# Altium schematic sheet main.SchDoc
size A4
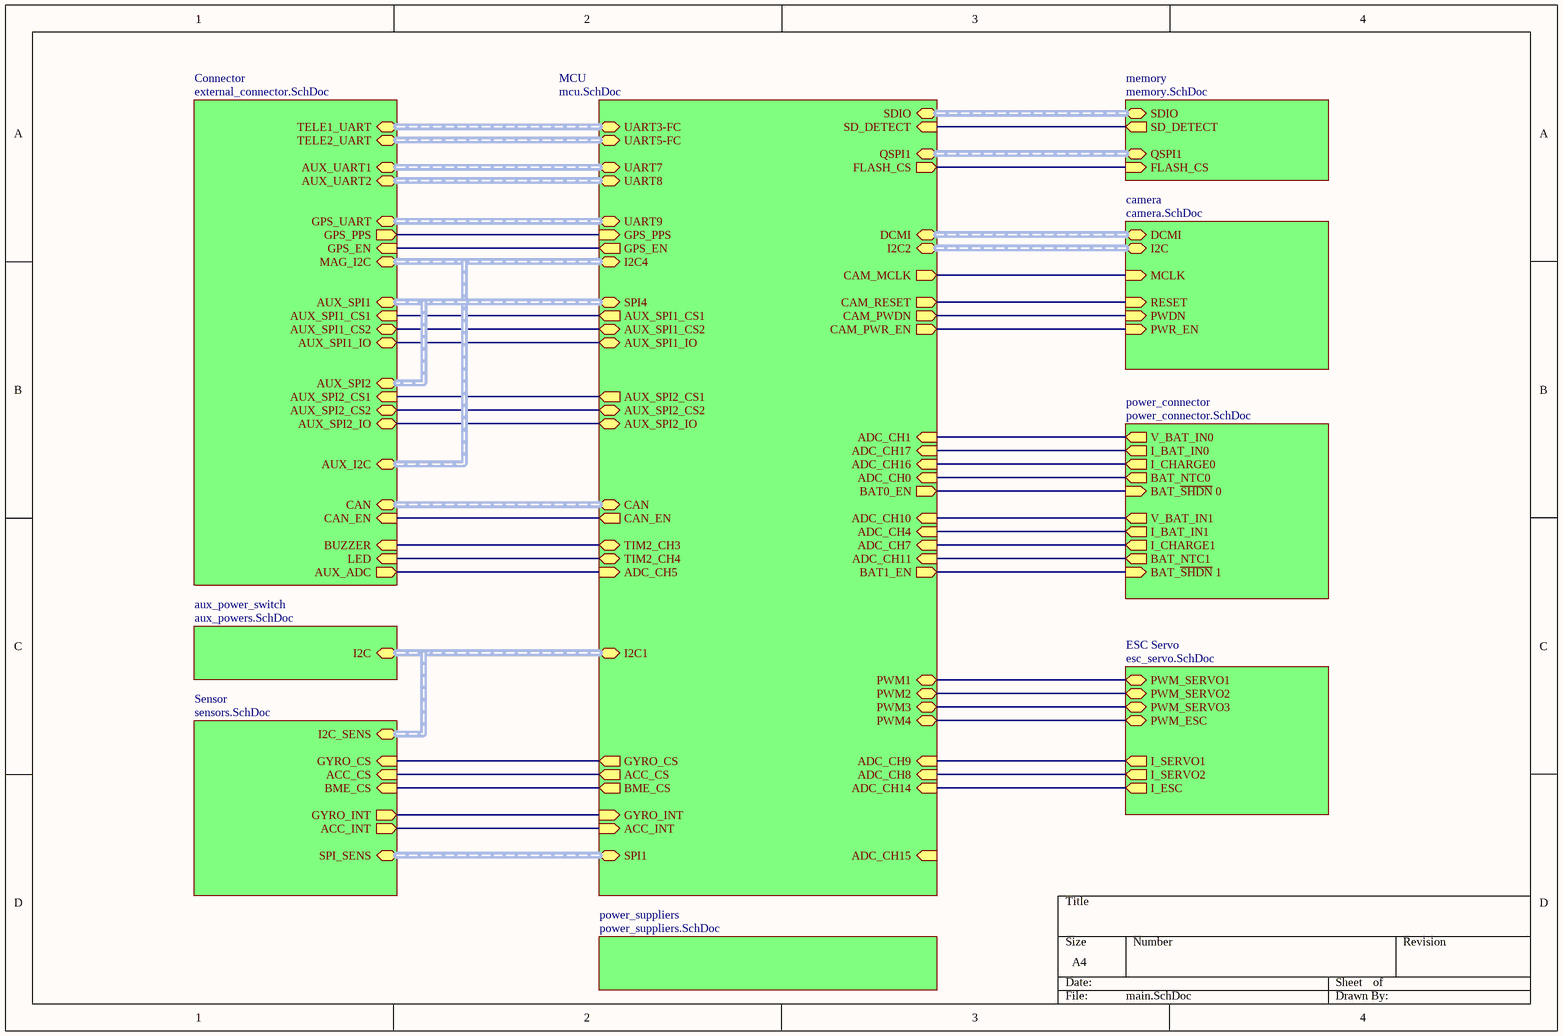
[diagram p0: main.SchDoc]

## Sub-sheets
aux_power_switch = aux_powers.SchDoc: I2C (harness I2C)
camera = camera.SchDoc: DCMI (harness DCMI), RESET (in), PWDN (in), I2C (harness I2C), MCLK (in), PWR_EN (in)
Connector = external_connector.SchDoc: TELE2_UART (harness UART-FC), CAN_EN (in), AUX_UART1 (harness UART), TELE1_UART (harness UART-FC), BUZZER (in), GPS_PPS (out), MAG_I2C (harness I2C), AUX_UART2 (harness UART), AUX_I2C (harness I2C), AUX_SPI2_IO (bidir), AUX_SPI2 (harness SPI), AUX_SPI1_IO (bidir), GPS_UART (harness UART), CAN (harness CAN), AUX_SPI1 (harness SPI), GPS_EN (in), LED (in), AUX_ADC (out), AUX_SPI2_CS2 (bidir), AUX_SPI2_CS1 (in), AUX_SPI1_CS1 (in), AUX_SPI1_CS2 (bidir)
ESC Servo = esc_servo.SchDoc: I_SERVO1 (out), PWM_SERVO2, I_SERVO2 (out), PWM_ESC, I_ESC (out), PWM_SERVO1, PWM_SERVO3
MCU = mcu.SchDoc: UART5-FC (harness UART-FC), UART3-FC (harness UART-FC), UART7 (harness UART), UART8 (harness UART), UART9 (harness UART), I2C1 (harness I2C), I2C2 (harness I2C), I2C4 (harness I2C), SPI4 (harness SPI), SPI1 (harness SPI), SDIO (harness SDIO), DCMI (harness DCMI), ADC_CH14 (in), ADC_CH4 (in), ADC_CH11 (in), ADC_CH8 (in), CAN (harness CAN), CAM_RESET (out), CAM_PWDN (out), CAM_MCLK (out), CAM_PWR_EN (out), ADC_CH17 (in), ADC_CH16 (in), PWM4, PWM1, PWM3, PWM2, TIM2_CH3, TIM2_CH4, SD_DETECT (in), QSPI1 (harness QSPI), FLASH_CS (out), BAT0_EN (out), BAT1_EN (out), ADC_CH0 (in), ADC_CH10 (in), ADC_CH15 (in), ADC_CH1 (in), ADC_CH7 (in), ADC_CH5 (in), GPS_EN (out), GPS_PPS (in), AUX_SPI1_CS2 (bidir), AUX_SPI1_IO (bidir), AUX_SPI1_CS1 (out), AUX_SPI2_CS1 (out), AUX_SPI2_IO (bidir), AUX_SPI2_CS2 (bidir), CAN_EN (out), ACC_INT (in), GYRO_INT (in), ACC_CS (out), GYRO_CS (out), BME_CS (out), ADC_CH9 (in)
memory = memory.SchDoc: SDIO (harness SDIO), SD_DETECT (out), FLASH_CS (in), QSPI1 (harness QSPI)
power_connector = power_connector.SchDoc: I_CHARGE1 (out), V_BAT_IN1 (out), I_BAT_IN1 (out), BAT_NTC0 (out), I_CHARGE0 (out), V_BAT_IN0 (out), BAT_NTC1 (out), I_BAT_IN0 (out), BAT_~{SHDN} 1 (in), BAT_~{SHDN} 0 (in)
power_suppliers = power_suppliers.SchDoc: no entries
Sensor = sensors.SchDoc: GYRO_CS (in), ACC_CS (in), GYRO_INT (out), ACC_INT (out), SPI_SENS (harness SPI), I2C_SENS (harness I2C), BME_CS (in)

## Nets
(unnamed): sheet MCU/ADC_CH14, sheet ESC Servo/I_ESC
(unnamed): sheet MCU/ADC_CH4, sheet power_connector/I_BAT_IN1
(unnamed): sheet MCU/ADC_CH11, sheet power_connector/BAT_NTC1
(unnamed): sheet MCU/ADC_CH8, sheet ESC Servo/I_SERVO2
(unnamed): sheet MCU/CAM_RESET, sheet camera/RESET
(unnamed): sheet MCU/CAM_PWDN, sheet camera/PWDN
(unnamed): sheet MCU/CAM_MCLK, sheet camera/MCLK
(unnamed): sheet MCU/CAM_PWR_EN, sheet camera/PWR_EN
(unnamed): sheet MCU/ADC_CH17, sheet power_connector/I_BAT_IN0
(unnamed): sheet MCU/ADC_CH16, sheet power_connector/I_CHARGE0
(unnamed): sheet MCU/PWM4, sheet ESC Servo/PWM_ESC
(unnamed): sheet MCU/PWM1, sheet ESC Servo/PWM_SERVO1
(unnamed): sheet MCU/PWM3, sheet ESC Servo/PWM_SERVO3
(unnamed): sheet MCU/PWM2, sheet ESC Servo/PWM_SERVO2
(unnamed): sheet MCU/TIM2_CH3, sheet Connector/BUZZER
(unnamed): sheet MCU/TIM2_CH4, sheet Connector/LED
(unnamed): sheet MCU/SD_DETECT, sheet memory/SD_DETECT
(unnamed): sheet MCU/FLASH_CS, sheet memory/FLASH_CS
(unnamed): sheet MCU/BAT0_EN, sheet power_connector/BAT_~{SHDN} 0
(unnamed): sheet MCU/BAT1_EN, sheet power_connector/BAT_~{SHDN} 1
(unnamed): sheet MCU/ADC_CH0, sheet power_connector/BAT_NTC0
(unnamed): sheet MCU/ADC_CH10, sheet power_connector/V_BAT_IN1
(unnamed): sheet MCU/ADC_CH1, sheet power_connector/V_BAT_IN0
(unnamed): sheet MCU/ADC_CH7, sheet power_connector/I_CHARGE1
(unnamed): sheet MCU/ADC_CH5, sheet Connector/AUX_ADC
(unnamed): sheet MCU/GPS_EN, sheet Connector/GPS_EN
(unnamed): sheet MCU/GPS_PPS, sheet Connector/GPS_PPS
(unnamed): sheet MCU/AUX_SPI1_CS2, sheet Connector/AUX_SPI1_CS2
(unnamed): sheet MCU/AUX_SPI1_IO, sheet Connector/AUX_SPI1_IO
(unnamed): sheet MCU/AUX_SPI1_CS1, sheet Connector/AUX_SPI1_CS1
(unnamed): sheet MCU/AUX_SPI2_CS1, sheet Connector/AUX_SPI2_CS1
(unnamed): sheet MCU/AUX_SPI2_IO, sheet Connector/AUX_SPI2_IO
(unnamed): sheet MCU/AUX_SPI2_CS2, sheet Connector/AUX_SPI2_CS2
(unnamed): sheet MCU/CAN_EN, sheet Connector/CAN_EN
(unnamed): sheet MCU/ACC_INT, sheet Sensor/ACC_INT
(unnamed): sheet MCU/GYRO_INT, sheet Sensor/GYRO_INT
(unnamed): sheet MCU/ACC_CS, sheet Sensor/ACC_CS
(unnamed): sheet MCU/GYRO_CS, sheet Sensor/GYRO_CS
(unnamed): sheet MCU/BME_CS, sheet Sensor/BME_CS
(unnamed): sheet MCU/ADC_CH9, sheet ESC Servo/I_SERVO1

## Buses and harness runs
harness sheet aux_power_switch/I2C = sheet MCU/I2C1 = sheet Sensor/I2C_SENS
harness sheet camera/DCMI = sheet MCU/DCMI
harness sheet camera/I2C = sheet MCU/I2C2
harness sheet Connector/AUX_I2C = sheet Connector/MAG_I2C = sheet MCU/I2C4
harness sheet Connector/AUX_SPI1 = sheet Connector/AUX_SPI2 = sheet MCU/SPI4
harness sheet Connector/AUX_UART1 = sheet MCU/UART7
harness sheet Connector/AUX_UART2 = sheet MCU/UART8
harness sheet Connector/CAN = sheet MCU/CAN
harness sheet Connector/GPS_UART = sheet MCU/UART9
harness sheet Connector/TELE1_UART = sheet MCU/UART3-FC
harness sheet Connector/TELE2_UART = sheet MCU/UART5-FC
harness sheet MCU/QSPI1 = sheet memory/QSPI1
harness sheet MCU/SDIO = sheet memory/SDIO
harness sheet MCU/SPI1 = sheet Sensor/SPI_SENS